# Altium schematic sheet FPGA_CONFIG.SchDoc
size A4
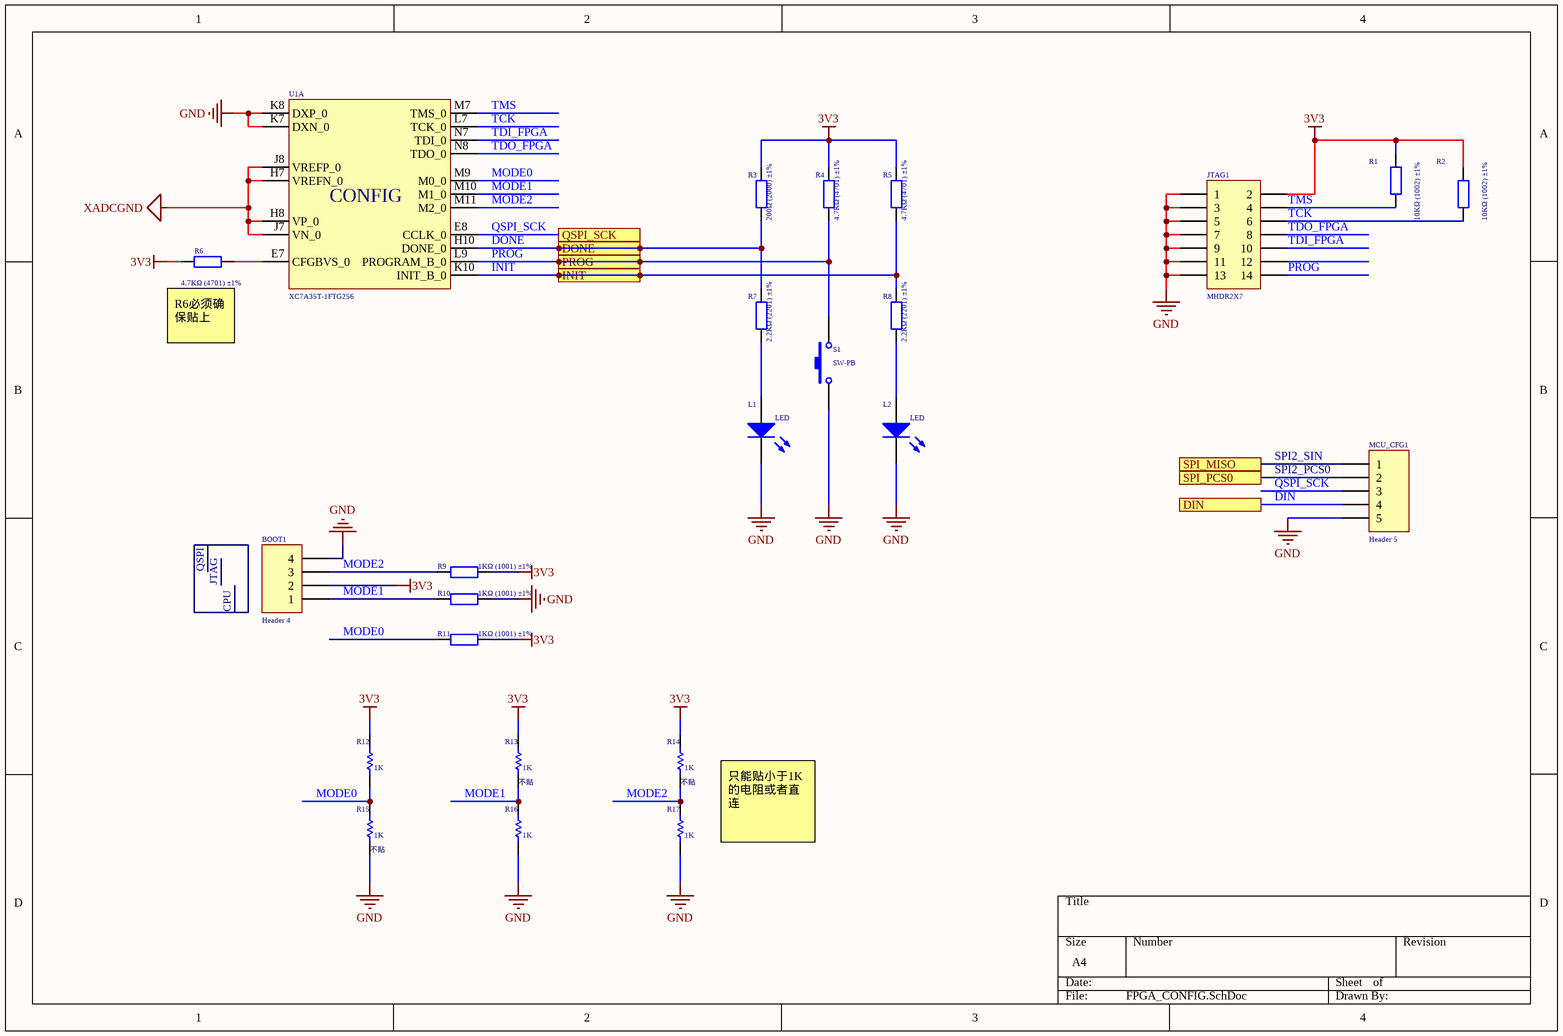
[diagram p0: FPGA_CONFIG.SchDoc]

## Parts
BOOT1  Header 4  [HDR1X4]
JTAG1  MHDR2X7  [SMT7*2-2MM]
L1  LED  [1608[0603]]
L2  LED  [1608[0603]]
MCU_CFG1  Header 5  [MHDR1X5]
R1  10KΩ (1002) ±1%  [0402_R]
R2  10KΩ (1002) ±1%  [0402_R]
R3  200Ω (2000) ±1%  [0402_R]
R4  4.7KΩ (4701) ±1%  [0402_R]
R5  4.7KΩ (4701) ±1%  [0402_R]
R6  4.7KΩ (4701) ±1%  [0402_R]
R7  2.2KΩ (2201) ±1%  [0402_R]
R8  2.2KΩ (2201) ±1%  [0402_R]
R9  1KΩ (1001) ±1%  [0402_R]
R10  1KΩ (1001) ±1%  [0402_R]
R11  1KΩ (1001) ±1%  [0402_R]
R12  value 1K  [1608[0603]]  (hidden comment: Res)
R13  不贴  value 1K  [1608[0603]]
R14  不贴  value 1K  [1608[0603]]
R15  不贴  value 1K  [1608[0603]]
R16  value 1K  [1608[0603]]  (hidden comment: Res)
R17  value 1K  [1608[0603]]  (hidden comment: Res)
S1  SW-PB  [key 3*4*2]
U1  XC7A35T-1FTG256  [BGA100P9X9-81A]  (part A of 7)

## Ports
DIN, DONE, INIT, PROG, QSPI_SCK, SPI_MISO, SPI_PCS0

## Nets
3V3: BOOT1.2 JTAG1.2 R1.2 R2.2 R3.2 R4.2 R5.2 R6.1 R9.2 R11.2 R12.2 R13.2 R14.2
GND: BOOT1.4 JTAG1.1 JTAG1.3 JTAG1.5 JTAG1.7 JTAG1.9 JTAG1.11 JTAG1.13 L1.2(K) L2.2(K) MCU_CFG1.5 R10.2 R15.1 R16.1 R17.1 S1.1 U1.K7(DXN_0) U1.K8(DXP_0)
XADCGND: U1.H7(VREFN_0) U1.H8(VP_0) U1.J7(VN_0) U1.J8(VREFP_0)
DIN: MCU_CFG1.4 ; port DIN
DONE: R3.1 R7.2 U1.H10(DONE_0) ; port DONE
INIT: R5.1 R8.2 U1.K10(INIT_B_0) ; port INIT
MODE0: R11.1 R12.1 R15.2 U1.M9(M0_0)
MODE1: BOOT1.1 R10.1 R13.1 R16.2 U1.M10(M1_0)
MODE2: BOOT1.3 R9.1 R14.1 R17.2 U1.M11(M2_0)
PROG: JTAG1.14 R4.1 S1.2 U1.L9(PROGRAM_B_0) ; port PROG
QSPI_SCK: MCU_CFG1.3 U1.E8(CCLK_0) ; port QSPI_SCK
SPI2_PCS0: MCU_CFG1.2 ; port SPI_PCS0
SPI2_SIN: MCU_CFG1.1 ; port SPI_MISO
TCK: JTAG1.6 R2.1 U1.L7(TCK_0)
TDI_FPGA: JTAG1.10 U1.N7(TDI_0)
TDO_FPGA: JTAG1.8 U1.N8(TDO_0)
TMS: JTAG1.4 R1.1 U1.M7(TMS_0)
NetL1_1: L1.1(A) R7.1
NetL2_1: L2.1(A) R8.1
NetR6_2: R6.2 U1.E7(CFGBVS_0)

Not connected (* = marked no-connect by the designer): JTAG1 12

## Notes on the sheet
- (near R6) R6必须确保贴上
- QSPI
- JTAG
- CPU
- 只能贴小于1K的电阻或者直连
- (in symbol XC7A35T-1FTG256, part A) CONFIG

## Library data of the parts
BOOT1 = Header 4: Header, 4-Pin; LatestRevisionDate: 17-Jul-2002; LatestRevisionNote: Re-released for DXP Platform.; Publisher: Altium Limited
JTAG1 = MHDR2X7: Header, 7-Pin, Dual row; LatestRevisionDate: 17-Jul-2002; LatestRevisionNote: Re-released for DXP Platform.; Publisher: Altium Limited
MCU_CFG1 = Header 5: Header, 5-Pin; LatestRevisionDate: 17-Jul-2002; LatestRevisionNote: Re-released for DXP Platform.; Publisher: Altium Limited
R1 R2 = 0402 10KΩ (1002) 1%: 贴片电阻; ComponentLink1Description: 供应商链接; ComponentLink1URL: http://www.szlcsc.com/product/details_26487.html; Package: 0402; Supplier: LC; SuppliersPartNumber: C25744
R3 = 0402 200Ω (2000) 1%: 贴片电阻; ComponentLink1Description: 供应商链接; ComponentLink1URL: http://www.szlcsc.com/product/details_25830.html; Package: 0402; Supplier: LC; SuppliersPartNumber: C25087
R4-R6 = 0402 4.7KΩ (4701) 1%: 贴片电阻; ComponentLink1Description: 供应商链接; ComponentLink1URL: http://www.szlcsc.com/product/details_26643.html; Package: 0402; Supplier: LC; SuppliersPartNumber: C25900
R7 R8 = 0402 2.2KΩ (2201) 1%: 贴片电阻; ComponentLink1Description: 供应商链接; ComponentLink1URL: http://www.szlcsc.com/product/details_26622.html; Package: 0402; Supplier: LC; SuppliersPartNumber: C25879
R9-R11 = 0402 1KΩ (1001) 1%: 贴片电阻; ComponentLink1Description: 供应商链接; ComponentLink1URL: http://www.szlcsc.com/product/details_12256.html; Package: 0402; Supplier: LC; SuppliersPartNumber: C11702
R12-R17 = Res: 贴片电阻; Published: 8-Jun-2000; LatestRevisionDate: 17-Jul-2002; LatestRevisionNote: Re-released for DXP Platform.; PackageReference: AXIAL-0.3; Publisher: Altium Limited
S1 = SW-PB: Switch; Published: 24-Mar-1999; LatestRevisionDate: 17-Jul-2002; LatestRevisionNote: Re-released for DXP Platform.; PackageReference: SPST-2; Publisher: Altium Limited; PackageDescription: Switch; 2 Leads